# EAGLE design MTCDisplay (EAGLE 7.6.0)

## Sheet 1 of 3
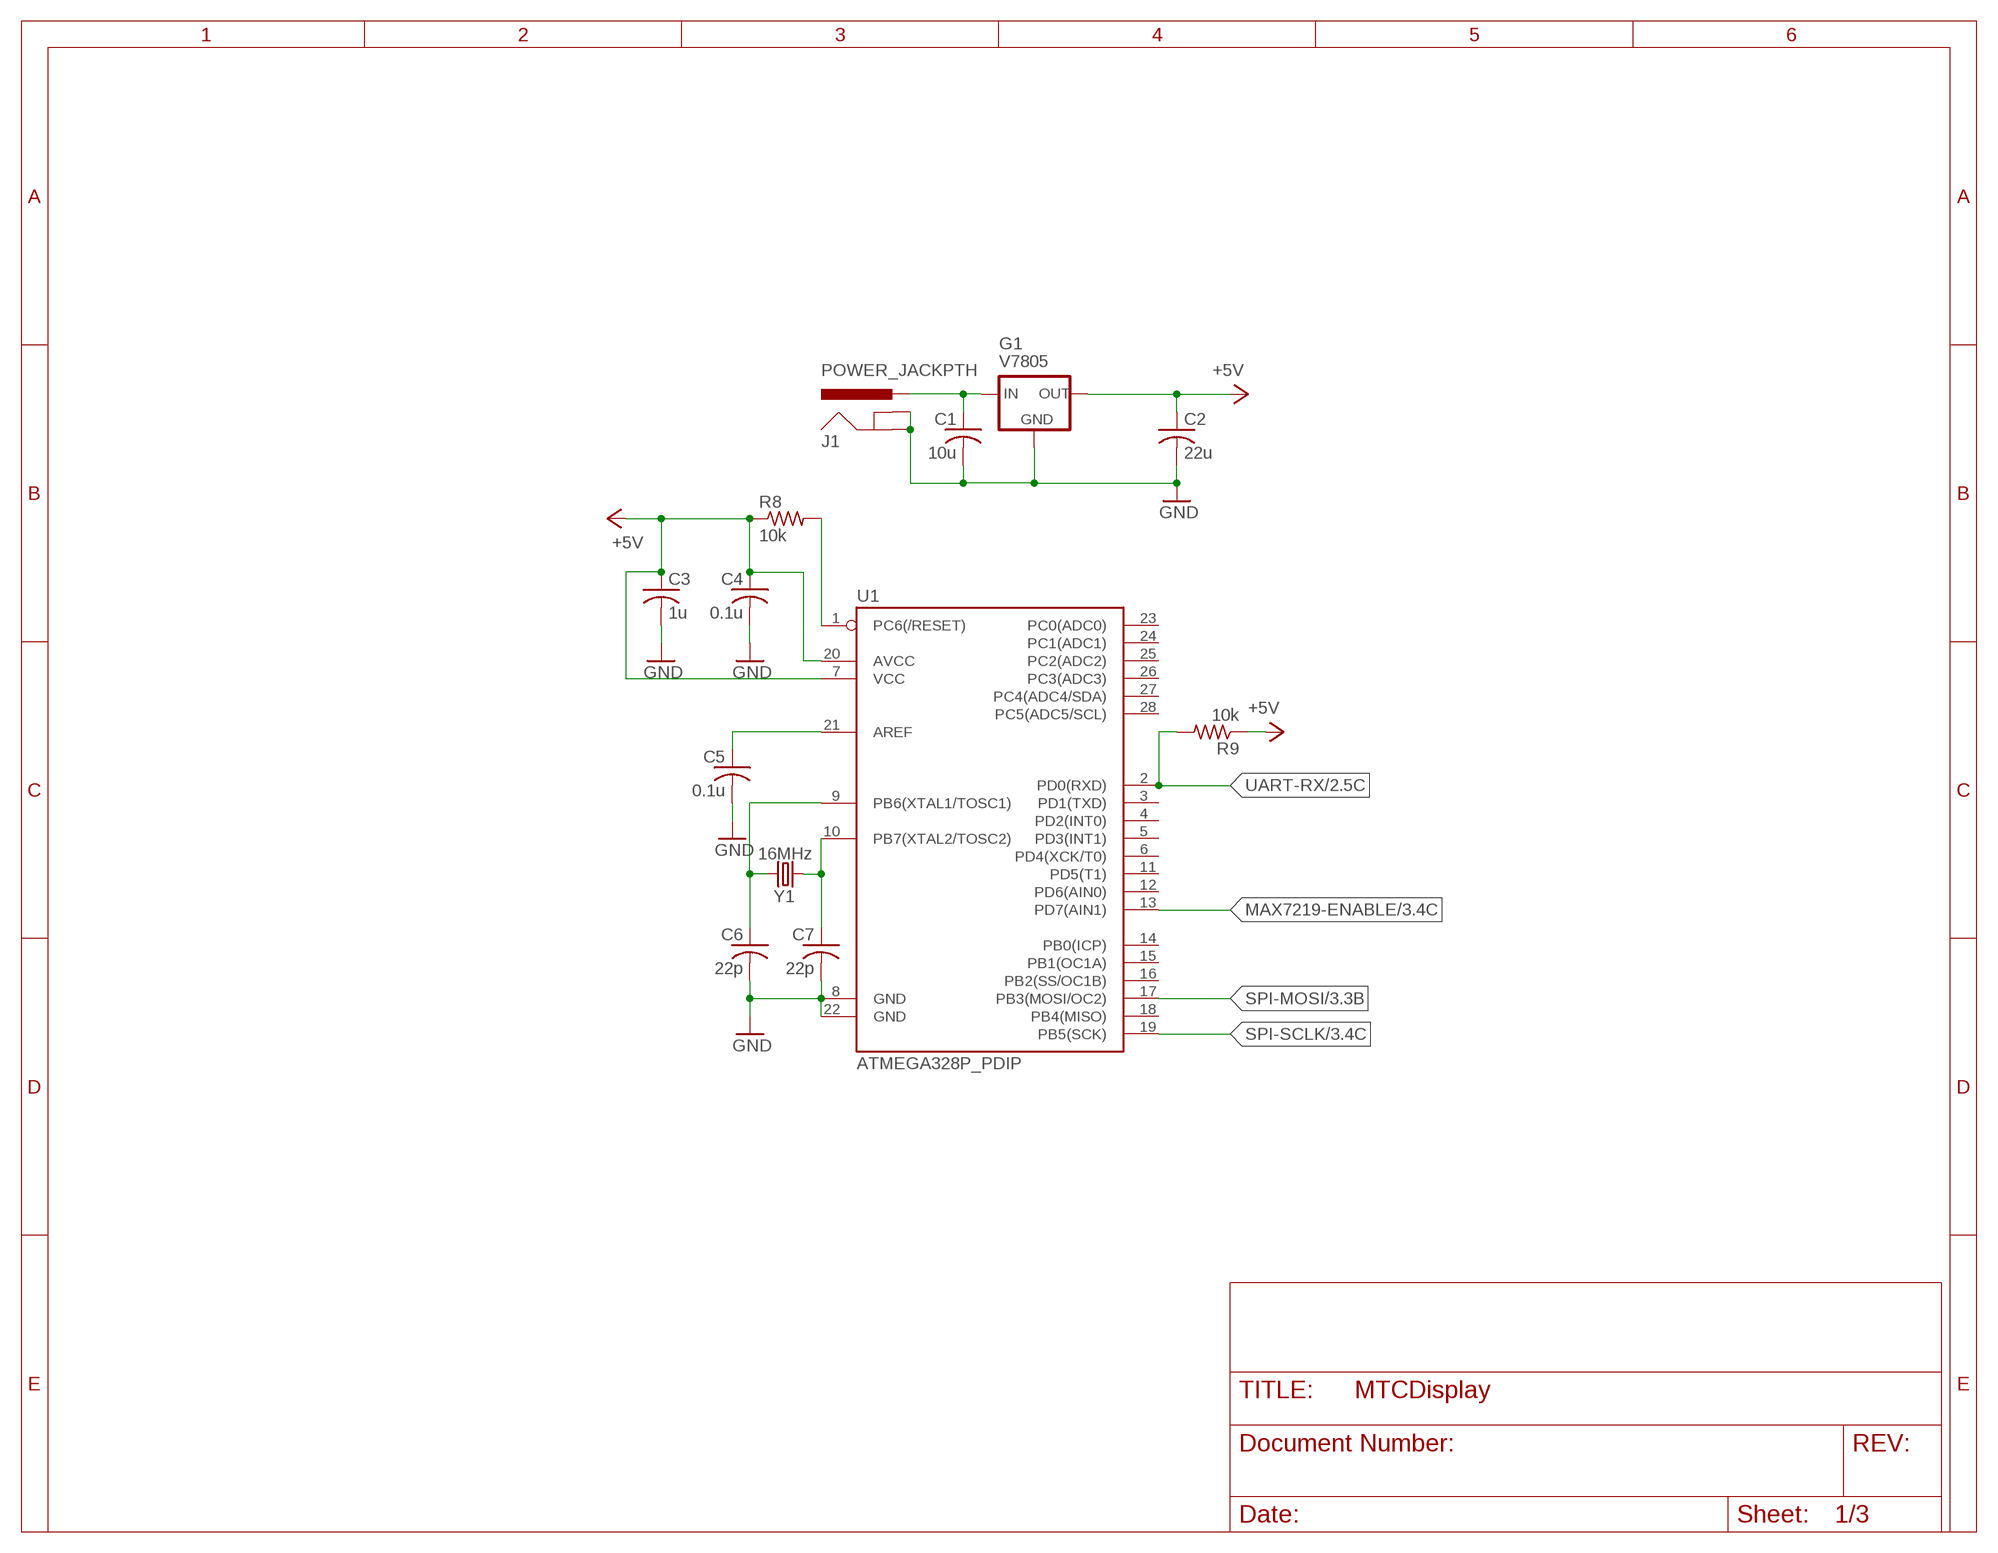
[diagram p0: schematic, sheet 1]

### Parts
C1  10u  C-USC0805K  [C0805K]
C2  22u  C-USC0805K  [C0805K]
C3  1u  C-USC0805K  [C0805K]
C4  0.1u  C-USC0805K  [C0805K]
C5  0.1u  C-USC0805K  [C0805K]
C6  22p  C-USC0805K  [C0805K]
C7  22p  C-USC0805K  [C0805K]
G1  V7805  [V7805]
J1  POWER_JACKPTH  [POWER_JACK_PTH]
R8  10k  R-US_R2012W  [R2012W]
R9  10k  R-US_R2012W  [R2012W]
U1  ATMEGA328P_PDIP  [DIL28-3]
Y1  16MHz  CRYSTALHC49US  [HC49US]

### Nets
+5V: C2.1 C3.1 C4.1 G1.OUT R8.1 R9.1 U1.7(VCC) U1.20(AVCC) ; also sheet 2,3
GND: C1.2 C2.2 C3.2 C4.2 C5.2 C6.2 C7.2 G1.GND J1.GND J1.GNDBREAK U1.8(GND) U1.22(GND) ; also sheet 2,3
MAX7219-ENABLE: U1.13(PD7(AIN1)) ; also sheet 3
N$5: C6.1 U1.9(PB6(XTAL1/TOSC1)) Y1.2
N$8: R8.2 U1.1(PC6(/RESET))
N$12: C5.1 U1.21(AREF)
N$15: C7.1 U1.10(PB7(XTAL2/TOSC2)) Y1.1
N$16: C1.1 G1.IN J1.PWR
SPI-MOSI: U1.17(PB3(MOSI/OC2)) ; also sheet 3
SPI-SCLK: U1.19(PB5(SCK)) ; also sheet 3
UART-RX: R9.2 U1.2(PD0(RXD)) ; also sheet 2
Unconnected: U1.3(PD1(TXD)) U1.4(PD2(INT0)) U1.5(PD3(INT1)) U1.6(PD4(XCK/T0)) U1.11(PD5(T1)) U1.12(PD6(AIN0)) U1.14(PB0(ICP)) U1.15(PB1(OC1A)) U1.16(PB2(SS/OC1B)) U1.18(PB4(MISO)) U1.23(PC0(ADC0)) U1.24(PC1(ADC1)) U1.25(PC2(ADC2)) U1.26(PC3(ADC3)) U1.27(PC4(ADC4/SDA)) U1.28(PC5(ADC5/SCL))

## Sheet 2 of 3
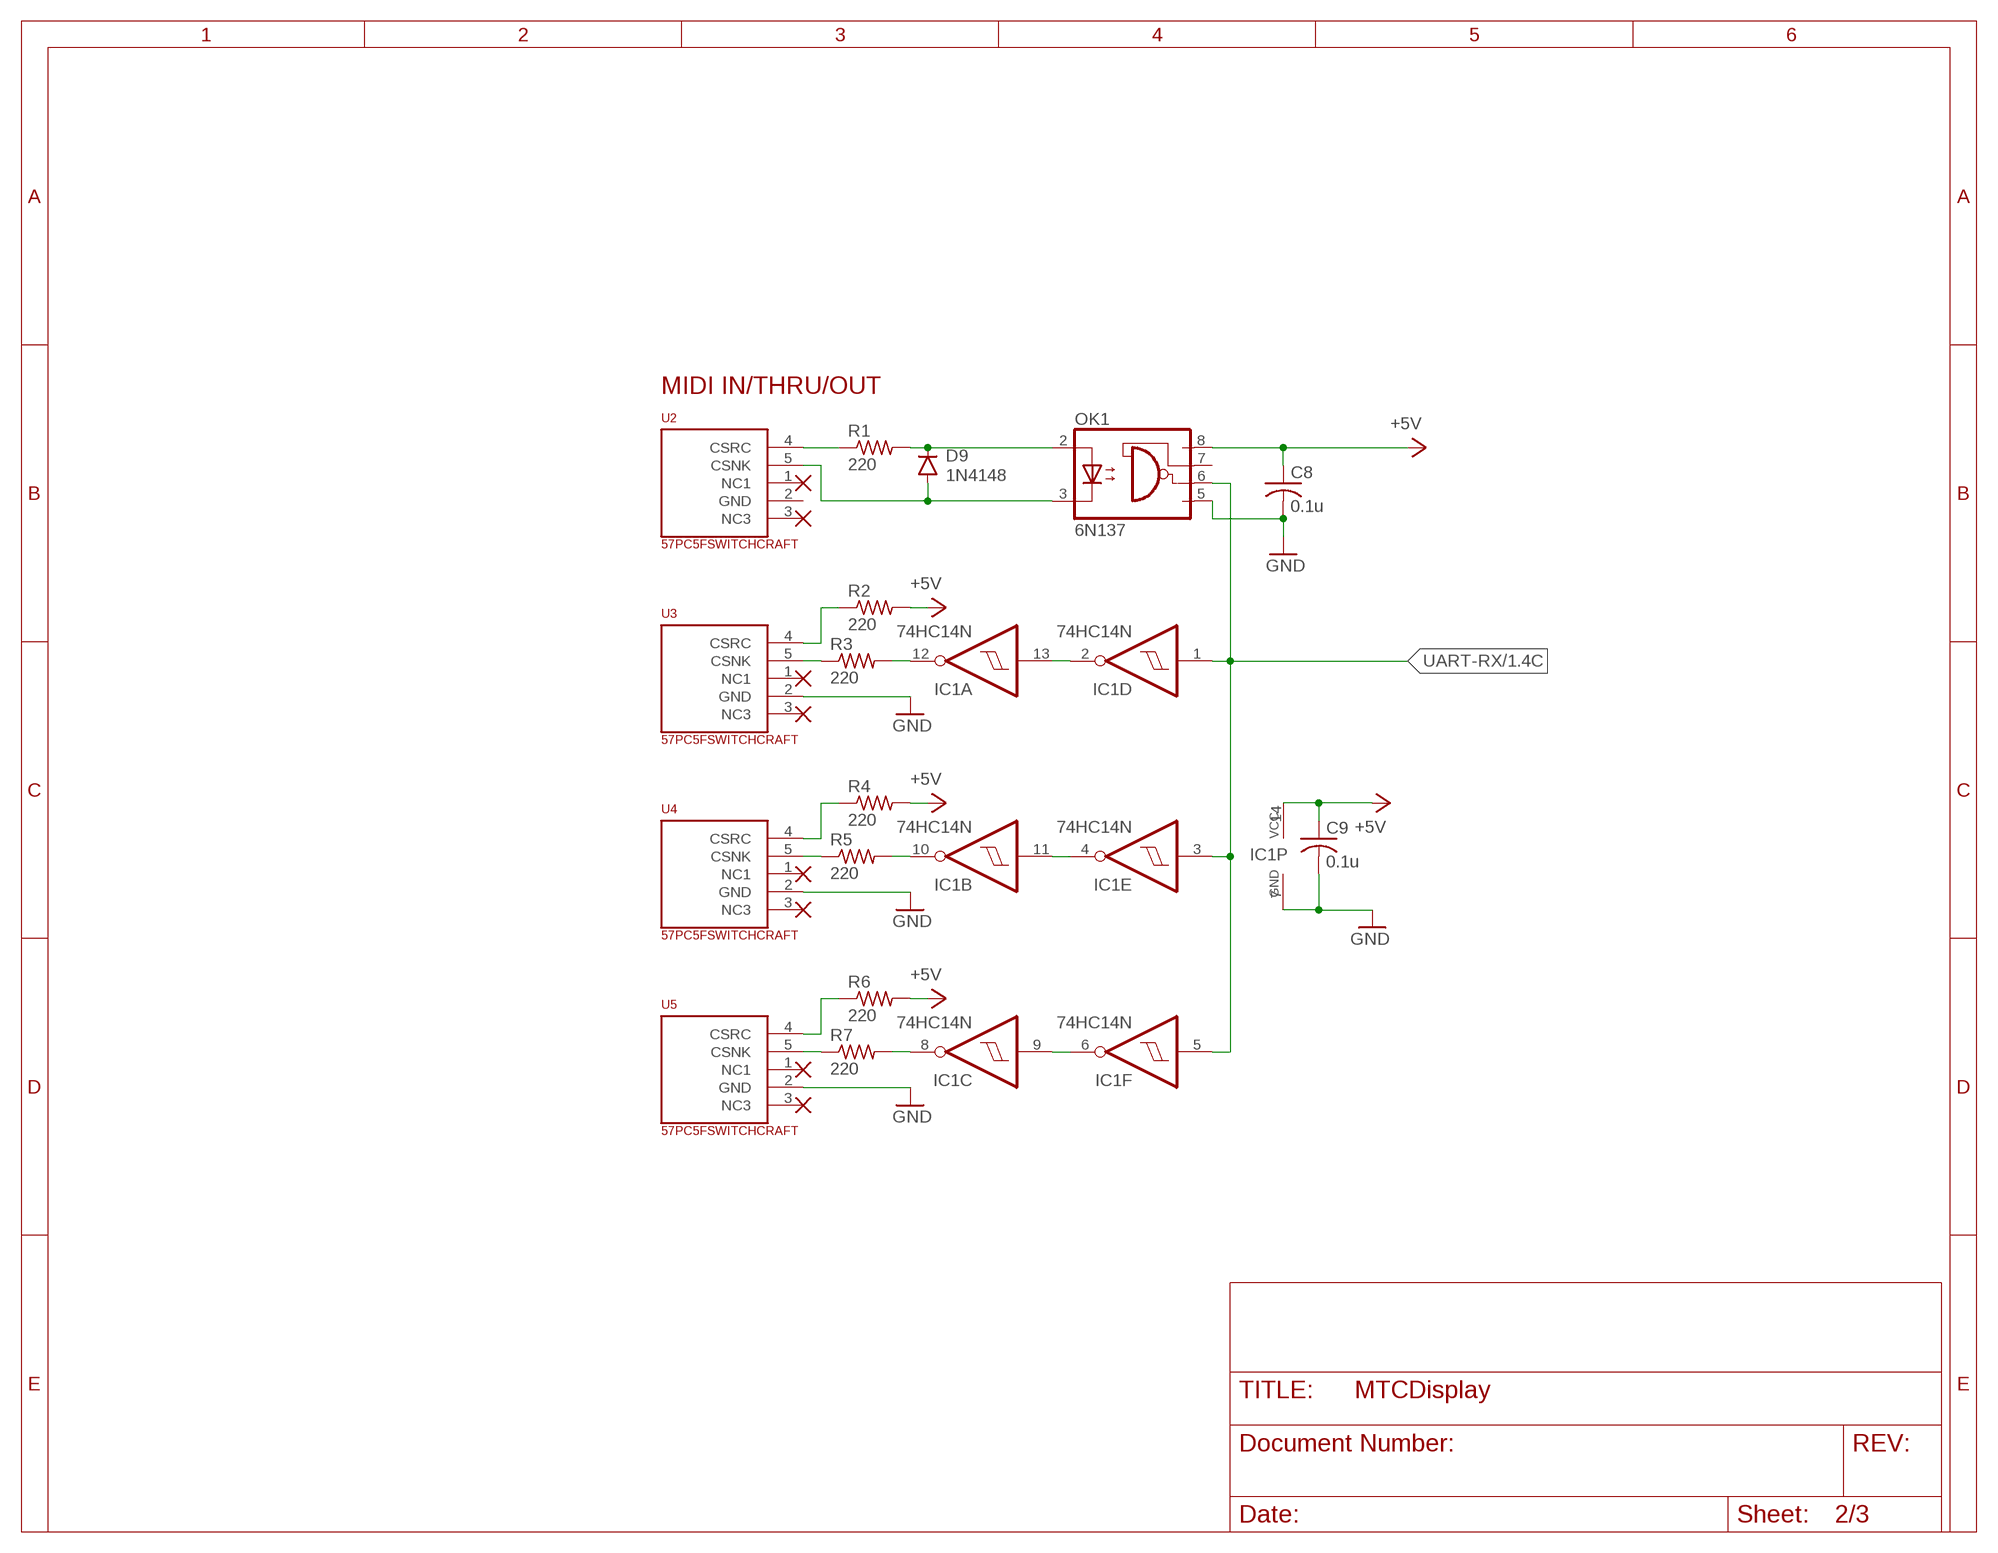
[diagram p1: schematic, sheet 2]

### Parts
C8  0.1u  C-USC0805K  [C0805K]
C9  0.1u  C-USC0805K  [C0805K]
D9  1N4148  DIODE1N4148  [DIODE-1N4148]
IC1  74HC14N  [DIL14]
OK1  6N137  [DIL08]
R1  220  R-US_R2012W  [R2012W]
R2  220  R-US_R2012W  [R2012W]
R3  220  R-US_R2012W  [R2012W]
R4  220  R-US_R2012W  [R2012W]
R5  220  R-US_R2012W  [R2012W]
R6  220  R-US_R2012W  [R2012W]
R7  220  R-US_R2012W  [R2012W]
U2  57PC5FSWITCHCRAFT  [DIN_5_FEMALE_SUPPORT]
U3  57PC5FSWITCHCRAFT  [DIN_5_FEMALE_SUPPORT]
U4  57PC5FSWITCHCRAFT  [DIN_5_FEMALE_SUPPORT]
U5  57PC5FSWITCHCRAFT  [DIN_5_FEMALE_SUPPORT]

### Nets
+5V: C8.1 C9.1 IC1.14(P:VCC) OK1.8(VCC) R2.2 R4.2 R6.2 ; also sheet 1,3
GND: C8.2 C9.2 IC1.7(P:GND) OK1.5(GND) U3.2(GND) U4.2(GND) U5.2(GND) ; also sheet 1,3
N$1: R1.1 U2.4(CSRC)
N$2: D9.C OK1.2(A) R1.2
N$3: D9.A OK1.3(C) U2.5(CSNK)
N$6: IC1.2(D:O) IC1.13(A:I)
N$7: IC1.12(A:O) R3.2
N$9: IC1.10(B:O) R5.2
N$10: R3.1 U3.5(CSNK)
N$11: R2.1 U3.4(CSRC)
N$18: IC1.8(C:O) R7.2
N$26: R5.1 U4.5(CSNK)
N$27: R4.1 U4.4(CSRC)
N$28: IC1.4(E:O) IC1.11(B:I)
N$29: IC1.6(F:O) IC1.9(C:I)
N$31: R7.1 U5.5(CSNK)
N$32: R6.1 U5.4(CSRC)
UART-RX: IC1.1(D:I) IC1.3(E:I) IC1.5(F:I) OK1.6(VO) ; also sheet 1
Unconnected: OK1.7(VE) U2.1(NC1) U2.2(GND) U2.3(NC3) U3.1(NC1) U3.3(NC3) U4.1(NC1) U4.3(NC3) U5.1(NC1) U5.3(NC3)

### Notes on the sheet
- MIDI IN/THRU/OUT

## Sheet 3 of 3
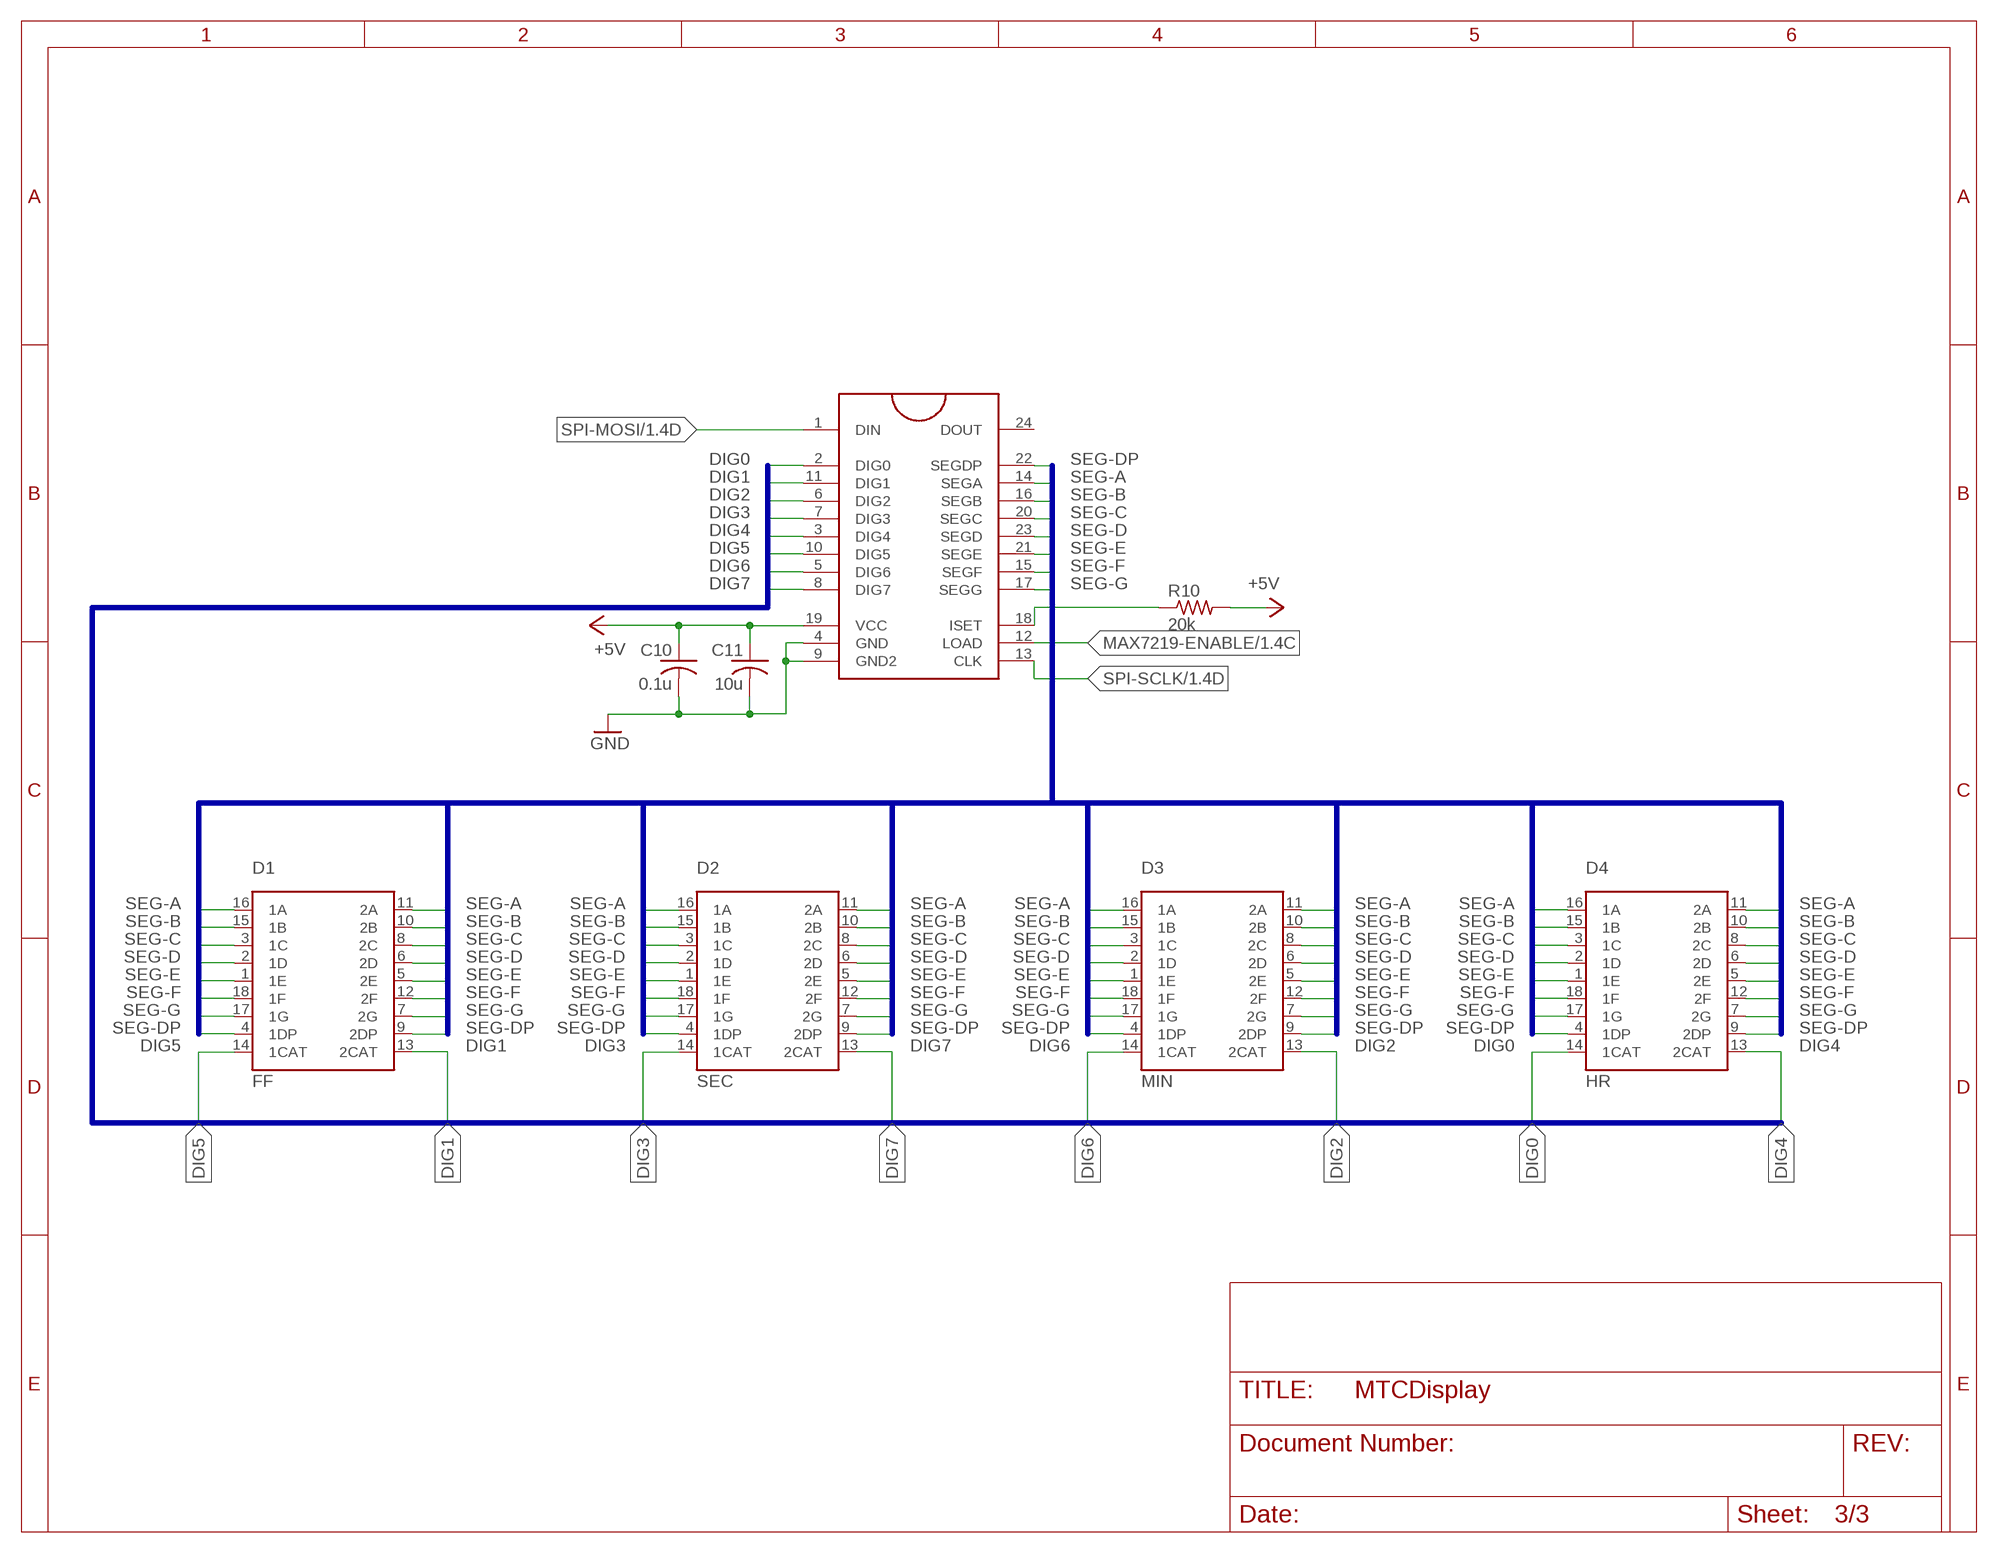
[diagram p2: schematic, sheet 3]

### Parts
C10  0.1u  C-USC0805K  [C0805K]
C11  10u  C-USC0805K  [C0805K]
D1  FF  299-XX-618-10-002000  [299-XX-43-618-10-002000]
D2  SEC  299-XX-618-10-002000  [299-XX-43-618-10-002000]
D3  MIN  299-XX-618-10-002000  [299-XX-43-618-10-002000]
D4  HR  299-XX-618-10-002000  [299-XX-43-618-10-002000]
R10  20k  R-US_R2012W  [R2012W]
U6  MAX7219DIP  [DIL24]

### Nets
+5V: C10.1 C11.1 R10.2 U6.19(VCC) ; also sheet 1,2
DIG0: D4.14(1CAT) U6.2(DIG0)
DIG1: D1.13(2CAT) U6.11(DIG1)
DIG2: D3.13(2CAT) U6.6(DIG2)
DIG3: D2.14(1CAT) U6.7(DIG3)
DIG4: D4.13(2CAT) U6.3(DIG4)
DIG5: D1.14(1CAT) U6.10(DIG5)
DIG6: D3.14(1CAT) U6.5(DIG6)
DIG7: D2.13(2CAT) U6.8(DIG7)
GND: C10.2 C11.2 U6.4(GND) U6.9(GND2) ; also sheet 1,2
MAX7219-ENABLE: U6.12(LOAD) ; also sheet 1
N$4: R10.1 U6.18(ISET)
SEG-A: D1.11(2A) D1.16(1A) D2.11(2A) D2.16(1A) D3.11(2A) D3.16(1A) D4.11(2A) D4.16(1A) U6.14(SEGA)
SEG-B: D1.10(2B) D1.15(1B) D2.10(2B) D2.15(1B) D3.10(2B) D3.15(1B) D4.10(2B) D4.15(1B) U6.16(SEGB)
SEG-C: D1.3(1C) D1.8(2C) D2.3(1C) D2.8(2C) D3.3(1C) D3.8(2C) D4.3(1C) D4.8(2C) U6.20(SEGC)
SEG-D: D1.2(1D) D1.6(2D) D2.2(1D) D2.6(2D) D3.2(1D) D3.6(2D) D4.2(1D) D4.6(2D) U6.23(SEGD)
SEG-DP: D1.4(1DP) D1.9(2DP) D2.4(1DP) D2.9(2DP) D3.4(1DP) D3.9(2DP) D4.4(1DP) D4.9(2DP) U6.22(SEGDP)
SEG-E: D1.1(1E) D1.5(2E) D2.1(1E) D2.5(2E) D3.1(1E) D3.5(2E) D4.1(1E) D4.5(2E) U6.21(SEGE)
SEG-F: D1.12(2F) D1.18(1F) D2.12(2F) D2.18(1F) D3.12(2F) D3.18(1F) D4.12(2F) D4.18(1F) U6.15(SEGF)
SEG-G: D1.7(2G) D1.17(1G) D2.7(2G) D2.17(1G) D3.7(2G) D3.17(1G) D4.7(2G) D4.17(1G) U6.17(SEGG)
SPI-MOSI: U6.1(DIN) ; also sheet 1
SPI-SCLK: U6.13(CLK) ; also sheet 1
Unconnected: U6.24(DOUT)

### Buses
SEG-A,SEG-B,SEG-C,SEG-D,SEG-E,SEG-F,SEG-G,SEG-DP
DIG0,DIG1,DIG2,DIG3,DIG4,DIG5,DIG6,DIG7

## Library data of the parts
C1-C11 = rcl:C-US: CAPACITOR, American symbol
D1-D4 = con-millmax:299-XX-618-10-002000: HDSP-5523 in Mill-Max 299-xx-618-10-002000 Socket
D9 = SparkFun-DiscreteSemi:DIODE: Diode These are standard reverse protection diodes and small signal diodes. SMA package can handle up to about 1A. SOD-323 can handle about 200mA. What the SOD-323 package when ordering, there are some mfgs out there that are 5-pin packages.; PROD_ID: DIO-08378
G1 = v-reg:V7805
IC1 = 74xx-eu:74*14: Hex schmitt trigger INVERTER
J1 = SparkFun-Connectors:POWER_JACK: Power Jack This is the standard 5.5mm barrel jack for power. The PTH is the most common, proven, reliable, footprint. The Slot footprint only works if the mill layer is transmitted to the PCB fab house so be warned. Mating wall wart : TOL-00298 (and others); PROD_ID: CONN-08197
OK1 = optocoupler:6N137: MOTOROLA OPTO COUPLER; MPN: 6N137; OC_FARNELL: 1328376; OC_NEWARK: 52M1895
R1-R10 = resistor:R-US_: RESISTOR, American symbol
U1 = SparkFun-DigitalIC:ATMEGA328P_PDIP: uC used in the Arduino 32kb flash, 1k EEPROM, 2k SRAM This is the through-hole version of this chip.
U2-U5 = con-switchcraft:57PC5F
U6 = SparkFun-DigitalIC:MAX7219: 8-digit, 8-segment LED display driver, serial input
Y1 = SparkFun-FreqCtrl:CRYSTAL: Various standard crystals. Proven footprints.

## Board
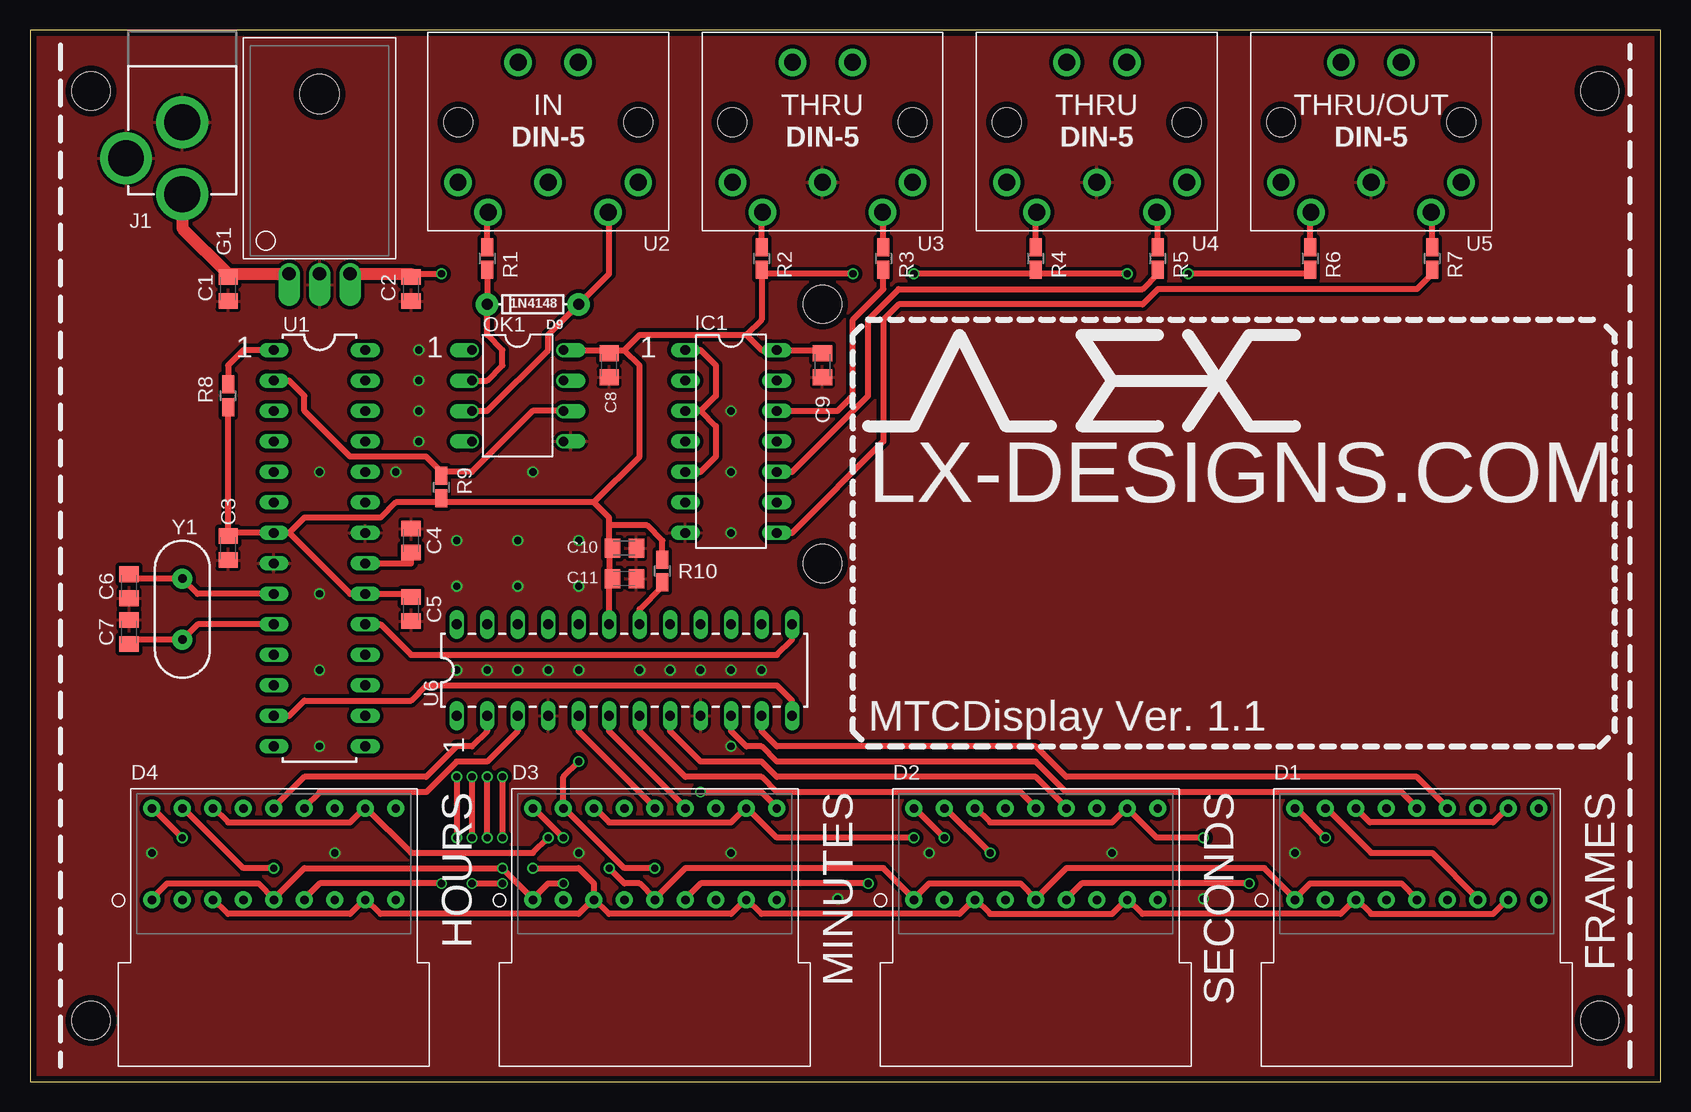
[diagram p3: board, top side]
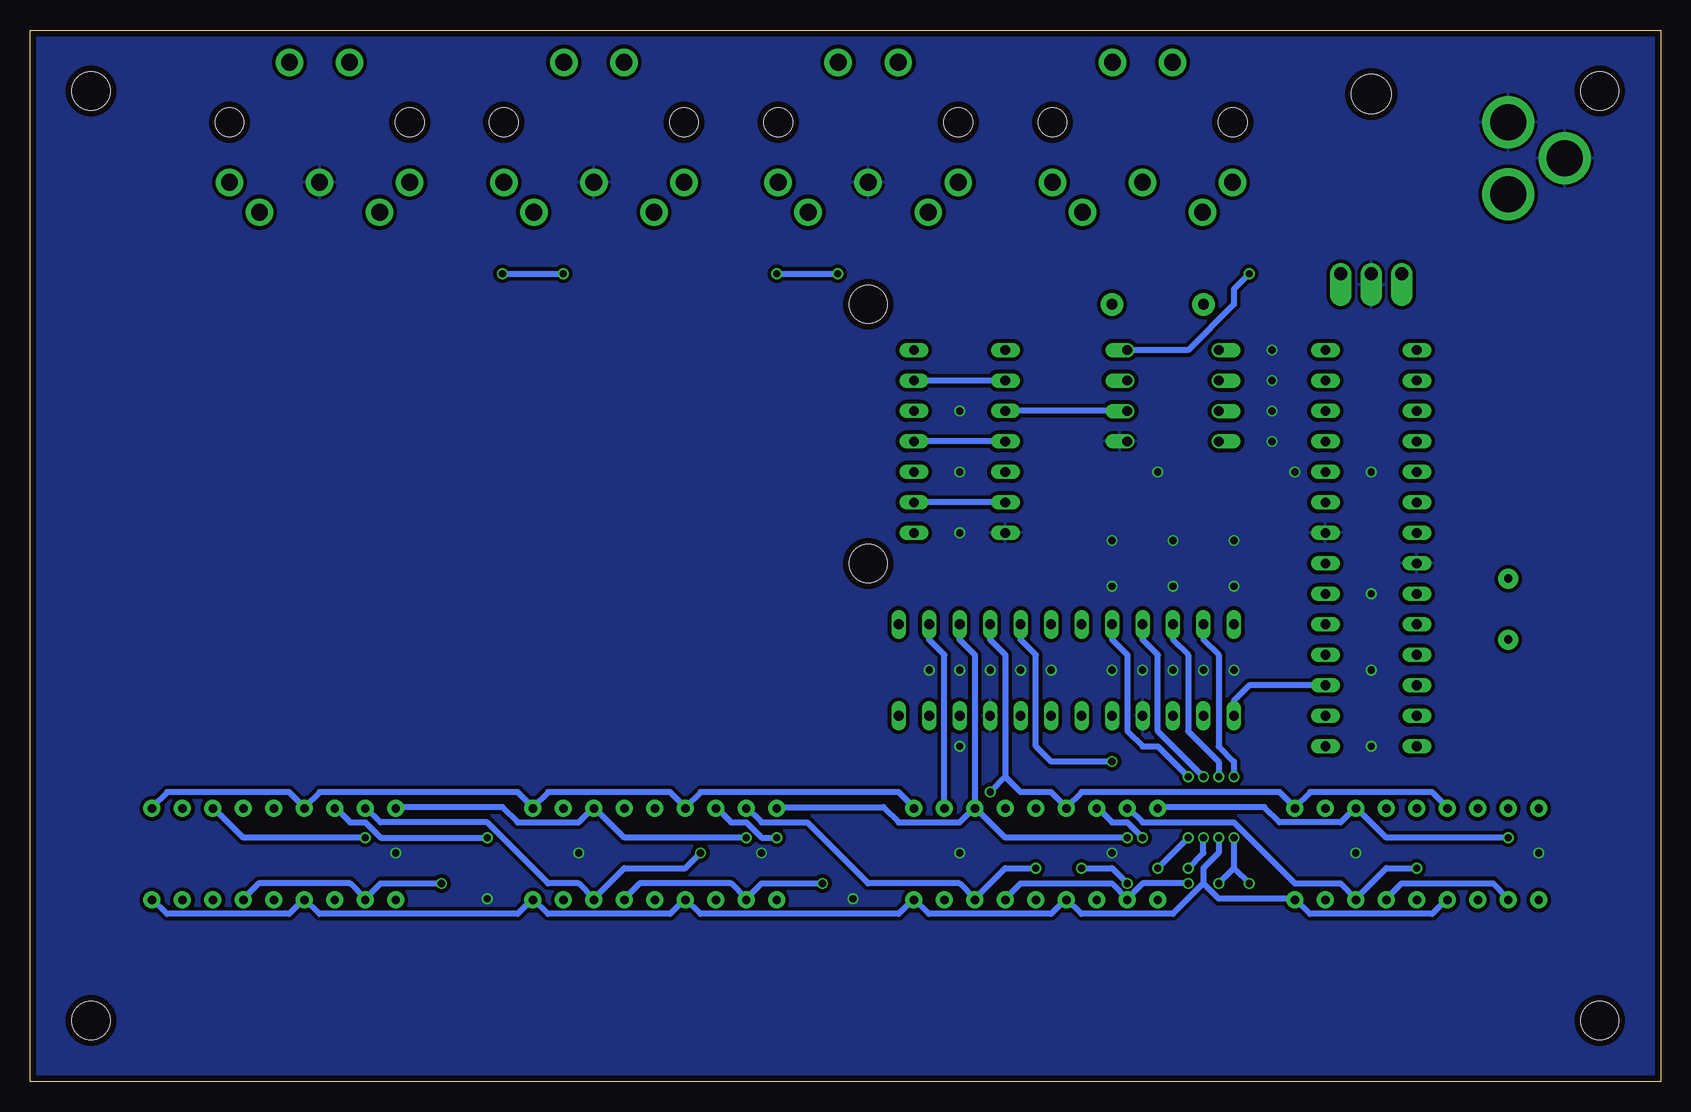
[diagram p4: board, bottom side, seen from below]

Size 135.89 x 87.63 mm. Coordinates in mm from the lower left corner, seen from the top.
Outline: 0,0 135.89,0 135.89,87.63 0,87.63 0,0
Copper layers (1*16): Top 0.035mm / dielectric 1.6mm / Bottom 0.035mm
Design rules "Elecrow_2-layer_PCB_eagle_rule": minimum track width 6mil, minimum drill 12mil, track to track 6mil, track to pad 6mil, pad to pad 6mil, via to via 8mil, smd to smd 0mil, copper to edge 20mil, drill to drill 10mil, minimum pad ring 6mil, minimum via ring 6mil, stop-mask expansion 0mil, vias tented up to drill 100mil, thermal gap 10mil
Holes 3.17 mm at 5.08,5.08 130.81,5.08 130.81,82.55 5.08,82.55 66.04,43.18 66.04,64.77
Holes 3.3 mm at 24.13,82.3

### Footprints (pad centres in the part's own frame; a part is rotated, then mirrored left to right if it is on the bottom)
C0805K = smd 1.3 x 1.6: 1 -1,0; 2 1,0
299-XX-43-618-10-002000 = drill 0.7 pad 1.422: 1 -10.16,-1.372; 2 -7.62,-1.372; 3 -5.08,-1.372; 4 -2.54,-1.372; 5 0,-1.372; 6 2.54,-1.372; 7 5.08,-1.372; 8 7.62,-1.372; 9 10.16,-1.372; 10 10.16,6.248; 11 7.62,6.248; 12 5.08,6.248; 13 2.54,6.248; 14 0,6.248; 15 -2.54,6.248; 16 -5.08,6.248; 17 -7.62,6.248; 18 -10.16,6.248
DIODE-1N4148 = drill 0.9 pad 1.88: A -3.81,0; C 3.81,0
V7805 = drill 1.1 pad 1.778 offset: GND 0,0; IN -2.54,0; OUT 2.54,0
DIL14 = drill 0.813 long: 1 -7.62,-3.81; 2 -5.08,-3.81; 3 -2.54,-3.81; 4 0,-3.81; 5 2.54,-3.81; 6 5.08,-3.81; 7 7.62,-3.81; 8 7.62,3.81; 9 5.08,3.81; 10 2.54,3.81; 11 0,3.81; 12 -2.54,3.81; 13 -5.08,3.81; 14 -7.62,3.81
POWER_JACK_PTH = drill 2.997 pad 4.318: GND 0,7.7; GNDBREAK 4.7,10.7; PWR 0,13.7
DIL08 = drill 0.813 offset: 1 -3.81,-3.81; 2 -1.27,-3.81; 3 1.27,-3.81; 4 3.81,-3.81; 5 3.81,3.81; 6 1.27,3.81; 7 -1.27,3.81; 8 -3.81,3.81
R2012W = smd 1.5 x 1: 1 -0.94,0; 2 0.94,0
DIL28-3 = drill 0.813 long: 1 -16.51,-3.81; 2 -13.97,-3.81; 3 -11.43,-3.81; 4 -8.89,-3.81; 5 -6.35,-3.81; 6 -3.81,-3.81; 7 -1.27,-3.81; 8 1.27,-3.81; 9 3.81,-3.81; 10 6.35,-3.81; 11 8.89,-3.81; 12 11.43,-3.81; 13 13.97,-3.81; 14 16.51,-3.81; 15 16.51,3.81; 16 13.97,3.81; 17 11.43,3.81; 18 8.89,3.81; 19 6.35,3.81; 20 3.81,3.81; 21 1.27,3.81; 22 -1.27,3.81; 23 -3.81,3.81; 24 -6.35,3.81; 25 -8.89,3.81; 26 -11.43,3.81; 27 -13.97,3.81; 28 -16.51,3.81
DIN_5_FEMALE_SUPPORT = drill 1.4 pad 2.286: 1 7.506,0; 2 0,0; 3 -7.506,0; 4 5.004,2.489; 5 -5.004,2.489; P$3 -2.502,-10.008; P$4 2.502,-10.008 | hole 2.388: -7.506,-5.004; 7.506,-5.004
DIL24 = drill 0.813 long: 1 -13.97,-3.81; 2 -11.43,-3.81; 3 -8.89,-3.81; 4 -6.35,-3.81; 5 -3.81,-3.81; 6 -1.27,-3.81; 7 1.27,-3.81; 8 3.81,-3.81; 9 6.35,-3.81; 10 8.89,-3.81; 11 11.43,-3.81; 12 13.97,-3.81; 13 13.97,3.81; 14 11.43,3.81; 15 8.89,3.81; 16 6.35,3.81; 17 3.81,3.81; 18 1.27,3.81; 19 -1.27,3.81; 20 -3.81,3.81; 21 -6.35,3.81; 22 -8.89,3.81; 23 -11.43,3.81; 24 -13.97,3.81
HC49US = drill 0.7 pad 1.651: 1 -2.54,0; 2 2.54,0

### Placement (x,y rotation side)
C1  16.51,66.04 270 top
C2  31.75,66.04 270 top
C3  16.51,44.45 270 top
C4  31.75,39.37 270 top
C5  31.75,45.09 90 top
C6  8.26,41.27 270 top
C7  8.26,37.47 90 top
C8  48.26,59.69 270 top
C9  66.04,59.69 270 top
C10  49.53,44.45 0 top
C11  49.53,41.91 0 top
D1  115.57,16.51 0 top
D2  83.82,16.51 0 top
D3  52.07,16.51 0 top
D4  20.32,16.51 0 top
D9  41.91,64.77 180 top
G1  24.13,67.31 0 top
IC1  58.42,53.34 270 top
J1  12.7,87.63 180 top
OK1  40.64,57.15 270 top
R1  38.1,68.58 270 top
R2  60.96,68.58 270 top
R3  71.12,68.58 270 top
R4  83.82,68.58 270 top
R5  93.98,68.58 270 top
R6  106.68,68.58 270 top
R7  116.84,68.58 270 top
R8  16.51,57.15 90 top
R9  34.29,49.53 90 top
R10  52.7,42.55 90 top
U1  24.13,44.45 270 top
U2  43.18,74.93 180 top
U3  66.04,74.93 180 top
U4  88.9,74.93 180 top
U5  111.76,74.93 180 top
U6  49.53,34.29 0 top
Y1  12.7,39.37 90 top

### Tracks (layer width: path | path; a pad name or v marks a point on that pad's centre or on a via)
+5V  (via drill 0.6)
  Top 0.508: 46.99,48.26 34.29,48.26 | 34.29,48.26 R9.1 | 21.59,45.72 26.67,40.64 U1.20 31.75,40.64 C4.1 | 21.59,45.72 U1.7 16.51,45.72 C3.1 R8.1 | 34.29,48.26 30.48,48.26 29.21,46.99 22.86,46.99 21.59,45.72 | 31.75,67.31 v34.29,67.31 | OK1.8 48.26,60.96 | C8.1 48.26,60.96 | 48.26,60.96 49.53,60.96 | R6.2 106.68,67.31 v96.52,67.31 | v91.44,67.31 83.82,67.31 | 83.82,67.31 R4.2 | 83.82,67.31 v73.66,67.31 | v68.58,67.31 61.29,67.31 | 61.29,67.31 R2.2 | 61.29,67.31 60.96,67.31 60.96,63.5 59.69,62.23 | C9.1 66.04,60.96 IC1.14 60.96,60.96 59.69,62.23 | U6.19 48.26,41.91 C11.1 48.26,42.18 48.26,43.81 48.53,44.09 C10.1 48.26,44.45 48.26,46.35 | R10.2 52.7,45.09 51.44,46.35 48.26,46.35 | 48.26,46.35 48.26,46.99 46.99,48.26 | 46.99,48.26 50.8,52.07 50.8,59.69 49.53,60.96 | 49.53,60.96 50.8,62.23 59.69,62.23
  Top 1.016: G1.OUT 31.75,67.31 C2.1
  Bottom 0.508: v34.29,67.31 35.56,66.04 35.56,64.77 39.37,60.96 OK1.8 | v96.52,67.31 v91.44,67.31 | v73.66,67.31 v68.58,67.31
DIG0
  Top 0.508: U6.2 38.1,29.21 36.83,27.94 35.56,27.94 33.02,25.4 22.86,25.4 20.32,22.86 D4.14
DIG1
  Top 0.508: D1.13 118.11,22.86 115.57,25.4 86.36,25.4 83.82,27.94 62.23,27.94 60.96,29.21 U6.11
DIG2
  Top 0.508: U6.6 48.26,29.21 54.61,22.86 D3.13
DIG3
  Top 0.508: D2.14 83.82,22.86 82.55,24.13 62.23,24.13 60.96,25.4 54.61,25.4 50.8,29.21 U6.7
DIG4
  Top 0.508: U6.3 40.64,29.21 38.1,26.67 35.56,26.67 33.02,24.13 24.13,24.13 22.86,22.86 D4.13
DIG5
  Top 0.508: D1.14 115.57,22.86 114.3,24.13 86.36,24.13 83.82,26.67 62.23,26.67 60.96,27.94 59.69,27.94 58.42,29.21 U6.10
DIG6
  Top 0.508: U6.5 45.72,29.21 52.07,22.86 D3.14
DIG7
  Top 0.508: D2.13 86.36,22.86 83.82,25.4 62.23,25.4 60.96,26.67 55.88,26.67 53.34,29.21 U6.8
GND  (via drill 0.6)
  other vias: 90.17,19.05 74.93,19.05 58.42,19.05 67.31,15.24 45.72,19.05 25.4,19.05 41.91,50.8 32.38,60.96 32.38,58.42 32.38,55.88 32.38,53.34 30.48,50.8 58.42,50.8 58.42,55.88 58.42,45.72 105.41,19.05 97.79,15.24 10.16,19.05 24.13,50.8 24.13,40.64 24.13,34.29 24.13,27.94 45.72,34.29 50.8,34.29 43.18,34.29 40.64,34.29 38.1,34.29 35.56,34.29 53.34,34.29 55.88,34.29 58.42,34.29 60.96,34.29 58.42,27.94 35.56,45.09 45.72,45.09 45.72,41.27 35.56,41.27 40.64,45.09 40.64,41.27
  pour Top (isolate 0.305): 0,0 0,87.63 135.89,87.63 135.89,0
  pour Bottom (isolate 0.305): 0,0 0,87.63 135.89,87.63 135.89,0
MAX7219-ENABLE
  Top 0.508: U1.13 21.59,30.48 22.86,31.75 31.75,31.75 33.02,33.02 62.23,33.02 63.5,31.75 U6.12
N$1
  Top 0.508: R1.1 38.1,72.36 U2.4
N$2
  Top 0.508: R1.2 D9.C 38.1,62.23 39.37,60.96 39.37,59.69 38.1,58.42 OK1.2
N$3
  Top 0.508: U2.5 48.26,72.36 48.26,67.31 D9.A 43.18,62.23 43.18,60.96 38.1,55.88 OK1.3
N$4
  Top 0.508: U6.18 50.8,39.37 52.7,41.27 R10.1
N$5
  Top 0.508: U1.9 13.97,40.64 Y1.2 8.26,41.91 C6.1
N$6
  Bottom 0.508: IC1.2 IC1.13
N$7
  Top 0.508: IC1.12 67.31,55.88 68.58,57.15 68.58,63.5 71.12,66.04 R3.2
N$8
  Top 0.508: U1.1 17.78,60.96 16.51,59.69 R8.2
N$9
  Top 0.508: IC1.10 63.5,50.8 69.85,57.15 69.85,63.5 72.39,66.04 92.71,66.04 93.98,67.31 R5.2
N$10
  Top 0.508: R3.1 71.12,72.36 U3.5
N$11
  Top 0.508: R2.1 60.96,72.36 U3.4
N$12
  Top 0.508: U1.21 31.75,43.18 C5.1
N$15
  Top 0.508: U1.10 13.97,38.1 Y1.1 8.26,36.83 C7.1
N$16
  Top 1.016: J1.PWR 12.7,71.12 16.51,67.31 | C1.1 16.51,67.31 | 16.51,67.31 G1.IN
N$18
  Top 0.508: R7.2 116.84,67.31 115.57,66.04 93.98,66.04 92.71,64.77 72.39,64.77 71.12,63.5 71.12,53.34 63.5,45.72 IC1.8
N$26
  Top 0.508: R5.1 93.98,72.36 U4.5
N$27
  Top 0.508: R4.1 83.82,72.36 U4.4
N$28
  Bottom 0.508: IC1.4 IC1.11
N$29
  Bottom 0.508: IC1.6 IC1.9
N$31
  Top 0.508: R7.1 116.84,72.36 U5.5
N$32
  Top 0.508: R6.1 106.68,72.36 U5.4
SEG-A  (via drill 0.6)
  Top 0.508: D4.16 15.24,22.86 16.51,21.59 26.67,21.59 27.94,22.86 | D2.16 78.74,22.86 80.01,21.59 90.17,21.59 91.44,22.86 D2.11 93.88,20.32 v97.79,20.32 | v73.66,20.32 62.23,20.32 59.69,22.86 | 27.94,22.86 31.75,19.05 41.91,19.05 v43.18,20.32 | 27.94,22.86 D4.11 | D1.11 123.19,22.86 121.92,21.59 111.66,21.59 D1.16 | D3.16 47.09,22.76 48.26,21.59 58.42,21.59 59.69,22.86 | 59.69,22.86 D3.11
  Bottom 0.508: v97.79,20.32 106.68,20.32 107.95,21.59 109.22,21.59 110.39,22.76 D1.16 | D2.16 78.64,22.76 77.47,21.59 76.2,21.59 74.93,20.32 v73.66,20.32 | D3.16 46.89,22.76 45.72,21.59 44.45,21.59 v43.18,20.32 | D3.11 59.69,35.56 60.96,36.83 U6.14
SEG-B  (via drill 0.6)
  Top 0.508: v55.88,24.13 60.96,24.13 62.23,22.86 D3.10
  Bottom 0.508: D4.15 17.78,22.86 19.05,24.13 29.21,24.13 30.48,22.86 | D4.10 30.48,22.86 | 30.48,22.86 31.75,24.13 48.26,24.13 49.53,22.86 | D3.15 49.53,22.86 | 49.53,22.86 50.8,24.13 53.34,24.13 54.61,25.4 | D3.10 62.23,22.86 63.5,24.13 80.01,24.13 81.28,22.86 | D2.15 81.28,22.86 | 81.28,22.86 82.55,24.13 92.71,24.13 93.98,22.86 | D2.10 93.98,22.86 | 93.98,22.86 95.25,24.13 111.76,24.13 113.03,22.86 | D1.15 113.03,22.86 | 113.03,22.86 114.3,24.13 124.46,24.13 125.73,22.86 D1.10 | U6.16 55.88,36.83 54.61,35.56 54.61,25.4 | 54.61,25.4 v55.88,24.13
SEG-C  (via drill 0.6)
  Top 0.508: D1.8 123.19,15.24 121.92,13.97 111.76,13.97 110.49,15.24 D1.3 110.39,15.14 109.22,13.97 92.71,13.97 91.44,15.24 | 78.74,15.24 80.01,13.97 90.17,13.97 91.44,15.24 | 91.44,15.24 D2.8 | D2.3 78.74,15.24 | 78.74,15.24 77.47,13.97 60.96,13.97 59.69,15.24 | D3.8 59.69,15.24 | 59.69,15.24 58.42,13.97 48.26,13.97 46.99,15.24 | 46.99,15.24 D3.3 46.99,16.51 45.72,17.78 v41.91,17.78 | 46.99,15.24 45.72,13.97 29.21,13.97 27.94,15.24 | 27.94,15.24 D4.8 | 27.94,15.24 26.67,13.97 16.51,13.97 15.24,15.24 D4.3 | v39.37,25.4 v39.37,20.32
  Bottom 0.508: U6.20 45.72,36.83 44.45,35.56 44.45,29.21 43.18,27.94 41.91,27.94 v39.37,25.4 | v39.37,20.32 v41.91,17.78
SEG-D  (via drill 0.6)
  Top 0.508: v101.6,16.51 87.63,16.51 86.36,15.24 D2.6 | D4.6 22.86,15.24 24.13,16.51 v34.29,16.51 | v69.85,16.51 55.88,16.51 54.61,15.24 D3.6 | v35.56,25.4 v35.56,20.32 | v36.83,16.51 v39.37,16.51
  Bottom 0.508: 107.95,15.24 109.22,16.51 116.84,16.51 118.11,15.24 D1.6 | 76.2,15.24 77.47,16.51 85.09,16.51 86.36,15.24 D2.6 | D1.2 107.95,15.24 | 107.95,15.24 106.68,16.51 v101.6,16.51 | D2.2 76.2,15.24 | 76.2,15.24 74.93,16.51 v69.85,16.51 | D3.6 54.61,15.24 53.34,16.51 45.72,16.51 44.45,15.24 | D3.2 44.45,15.24 | 44.45,15.24 43.18,16.51 v39.37,16.51 | D4.6 22.86,15.24 21.59,16.51 13.97,16.51 12.7,15.24 D4.2 | U6.23 38.1,36.83 36.83,35.56 36.83,27.94 35.56,26.67 v35.56,25.4 | v35.56,20.32 35.56,17.78 | v36.83,16.51 35.56,17.78 | 35.56,17.78 v34.29,16.51
SEG-DP  (via drill 0.6)
  Top 0.508: v36.83,25.4 v36.83,20.32
  Bottom 0.508: 113.03,15.24 114.3,13.97 124.46,13.97 125.73,15.24 D1.9 | D4.4 17.78,15.24 19.05,13.97 29.21,13.97 30.48,15.24 | D4.9 30.48,15.24 | 49.53,15.24 48.26,13.97 40.64,13.97 38.1,16.51 | D3.4 49.53,15.24 | 49.53,15.24 50.8,13.97 60.96,13.97 62.23,15.24 | D3.9 62.23,15.24 | 62.23,15.24 63.5,13.97 80.01,13.97 81.28,15.24 | D2.4 81.28,15.24 | 81.28,15.24 82.55,13.97 92.71,13.97 93.98,15.24 | U6.22 40.64,36.83 39.37,35.56 39.37,29.21 36.83,26.67 v36.83,25.4 | v36.83,20.32 36.83,19.05 38.1,17.78 38.1,16.51 | 30.48,15.24 36.83,15.24 38.1,16.51 | D2.9 93.98,15.24 | 93.98,15.24 95.25,13.97 111.76,13.97 113.03,15.24 | 113.03,15.24 D1.4
SEG-E  (via drill 0.6)
  Top 0.508: D4.1 10.16,15.24 11.43,16.51 19.05,16.51 20.32,15.24 | 73.66,15.24 74.93,16.51 82.55,16.51 83.82,15.24 | 105.41,15.24 106.68,16.51 114.3,16.51 115.57,15.24 D1.5 | D1.1 105.41,15.24 | 105.41,15.24 102.87,17.78 86.36,17.78 83.82,15.24 | 83.82,15.24 D2.5 | D2.1 73.66,15.24 | 73.66,15.24 71.12,17.78 54.61,17.78 52.07,15.24 | D3.5 52.07,15.24 | 52.07,15.24 50.8,16.51 49.53,16.51 v48.26,17.78 | 41.91,15.24 43.18,16.51 v44.45,16.51 | D3.1 41.91,15.24 | 41.91,15.24 v39.37,17.78 22.86,17.78 20.32,15.24 | 20.32,15.24 D4.5 | v38.1,20.32 v38.1,25.4
  Bottom 0.508: v39.37,17.78 38.1,19.05 v38.1,20.32 | v38.1,25.4 41.91,29.21 41.91,35.56 43.18,36.83 U6.21 | v48.26,17.78 45.72,17.78 v44.45,16.51
SEG-F  (via drill 0.6)
  Top 0.508: D1.18 105.51,22.76 v107.95,20.32 | v76.2,20.32 73.66,22.86 D2.18 | D4.18 10.16,22.86 v12.7,20.32 | D3.18 41.91,22.86 v44.45,20.32
  Bottom 0.508: v76.2,20.32 86.36,20.32 88.9,22.86 | 88.9,22.86 90.17,21.59 95.25,21.59 96.52,22.86 105.31,22.86 D1.18 | 88.9,22.86 D2.12 | v107.95,20.32 118.11,20.32 120.65,22.86 D1.12 | D2.18 73.66,22.86 64.77,22.86 63.5,21.59 58.42,21.59 57.15,22.86 | v12.7,20.32 22.86,20.32 25.4,22.86 | D4.12 25.4,22.86 | 25.4,22.86 26.67,21.59 31.75,21.59 33.02,22.86 41.91,22.86 D3.18 | v44.45,20.32 54.61,20.32 57.15,22.86 | U6.15 58.42,36.83 57.15,35.56 57.15,22.86 | 57.15,22.86 D3.12
SEG-G  (via drill 0.6)
  Top 0.508: v80.01,19.05 76.2,22.86 D2.17 | D1.17 108.05,22.76 111.76,19.05 116.84,19.05 120.65,15.24 D1.7 | v52.07,17.78 49.53,17.78 44.45,22.86 | 44.45,22.86 D3.17 | v20.32,17.78 17.78,17.78 12.7,22.86 D4.17 | 44.45,22.86 44.45,25.4 v45.72,26.67
  Bottom 0.508: v80.01,19.05 81.28,17.78 86.36,17.78 88.9,15.24 | 88.9,15.24 90.17,16.51 92.71,16.51 97.79,21.59 106.68,21.59 107.95,22.86 D1.17 | D2.17 76.1,22.76 74.93,21.59 71.12,21.59 66.04,16.51 58.42,16.51 57.15,15.24 | 57.15,15.24 54.61,17.78 v52.07,17.78 | D3.7 57.15,15.24 | D3.17 44.35,22.76 43.18,21.59 35.56,21.59 30.48,16.51 26.67,16.51 25.4,15.24 | v20.32,17.78 22.86,17.78 25.4,15.24 | v45.72,26.67 50.8,26.67 52.07,27.94 52.07,35.56 53.34,36.83 U6.17 | 25.4,15.24 D4.7 | 88.9,15.24 D2.7
SPI-MOSI
  Bottom 0.508: U1.17 34.29,33.02 35.56,31.75 U6.1
SPI-SCLK
  Top 0.508: U1.19 29.21,38.1 31.75,35.56 62.23,35.56 63.5,36.83 U6.13
UART-RX
  Top 0.508: IC1.1 55.88,60.96 57.15,59.69 57.15,57.15 55.88,55.88 | U1.2 21.59,58.42 22.86,57.15 22.86,55.88 26.67,52.07 33.02,52.07 34.29,50.8 | OK1.6 41.91,55.88 36.83,50.8 34.29,50.8 | 34.29,50.8 R9.2 | IC1.3 55.88,55.88 | 55.88,55.88 57.15,54.61 57.15,52.07 55.88,50.8 IC1.5
  Bottom 0.508: OK1.6 IC1.3

### Text on the board
tPlace: IN | THRU | THRU | THRU/OUT | 1 | 1 | 1 | LX-DESIGNS.COM | MTCDisplay Ver. 1.1 | 1 | HOURS | MINUTES | SECONDS | FRAMES